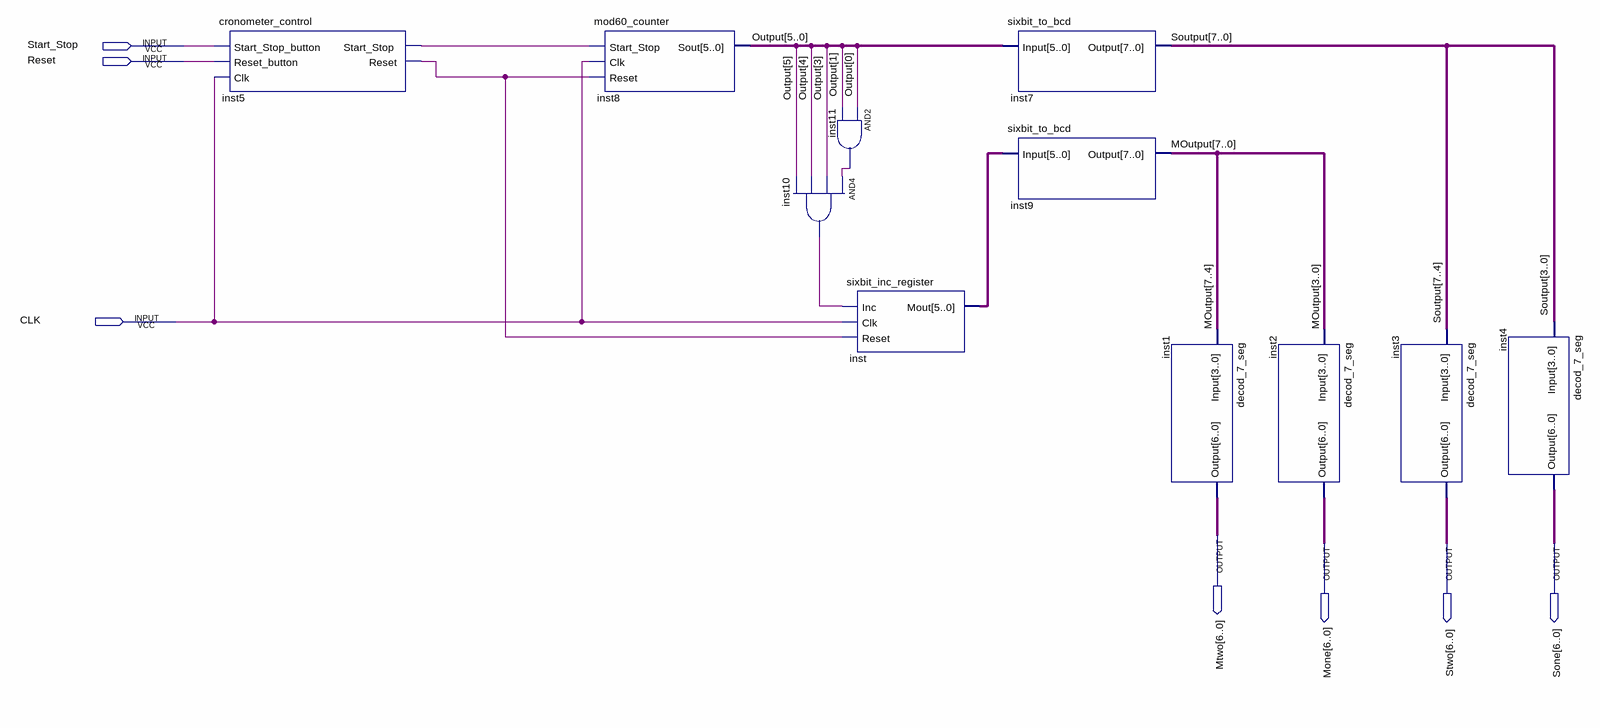
[diagram p0: schematic sheet]
// Quartus schematic trabalho_final.bdf as structural Verilog: 11 symbols, 7 pins
module trabalho_final (
  input  Start_Stop,
  input  Reset,
  input  CLK,
  output [6:0] Mtwo,
  output [6:0] Mone,
  output [6:0] Stwo,
  output [6:0] Sone
);

  wire inst5_reset, inst5_start_stop, inst10_out, inst11_out;
  wire [5:0] inst_mout, Output;
  wire [7:0] MOutput, Soutput;

  cronometer_control inst5 (
    .Start_Stop_button(Start_Stop), .Reset_button(Reset), .Clk(CLK), .Start_Stop(inst5_start_stop),
    .Reset(inst5_reset));
  mod60_counter inst8 (.Start_Stop(inst5_start_stop), .Clk(CLK), .Reset(inst5_reset), .Sout(Output));
  and inst11 (inst11_out, Output[0], Output[1]);
  and inst10 (inst10_out, inst11_out, Output[3], Output[4], Output[5]);
  sixbit_inc_register inst (.Inc(inst10_out), .Clk(CLK), .Reset(inst5_reset), .Mout(inst_mout));
  sixbit_to_bcd inst7 (.Input(Output), .Output(Soutput));
  sixbit_to_bcd inst9 (.Input(inst_mout), .Output(MOutput));
  decod_7_seg inst1 (.Input(MOutput[7:4]), .Output(Mtwo));
  decod_7_seg inst2 (.Input(MOutput[3:0]), .Output(Mone));
  decod_7_seg inst3 (.Input(Soutput[7:4]), .Output(Stwo));
  decod_7_seg inst4 (.Input(Soutput[3:0]), .Output(Sone));
endmodule
